# EAGLE design RB01 (EAGLE 6.3)
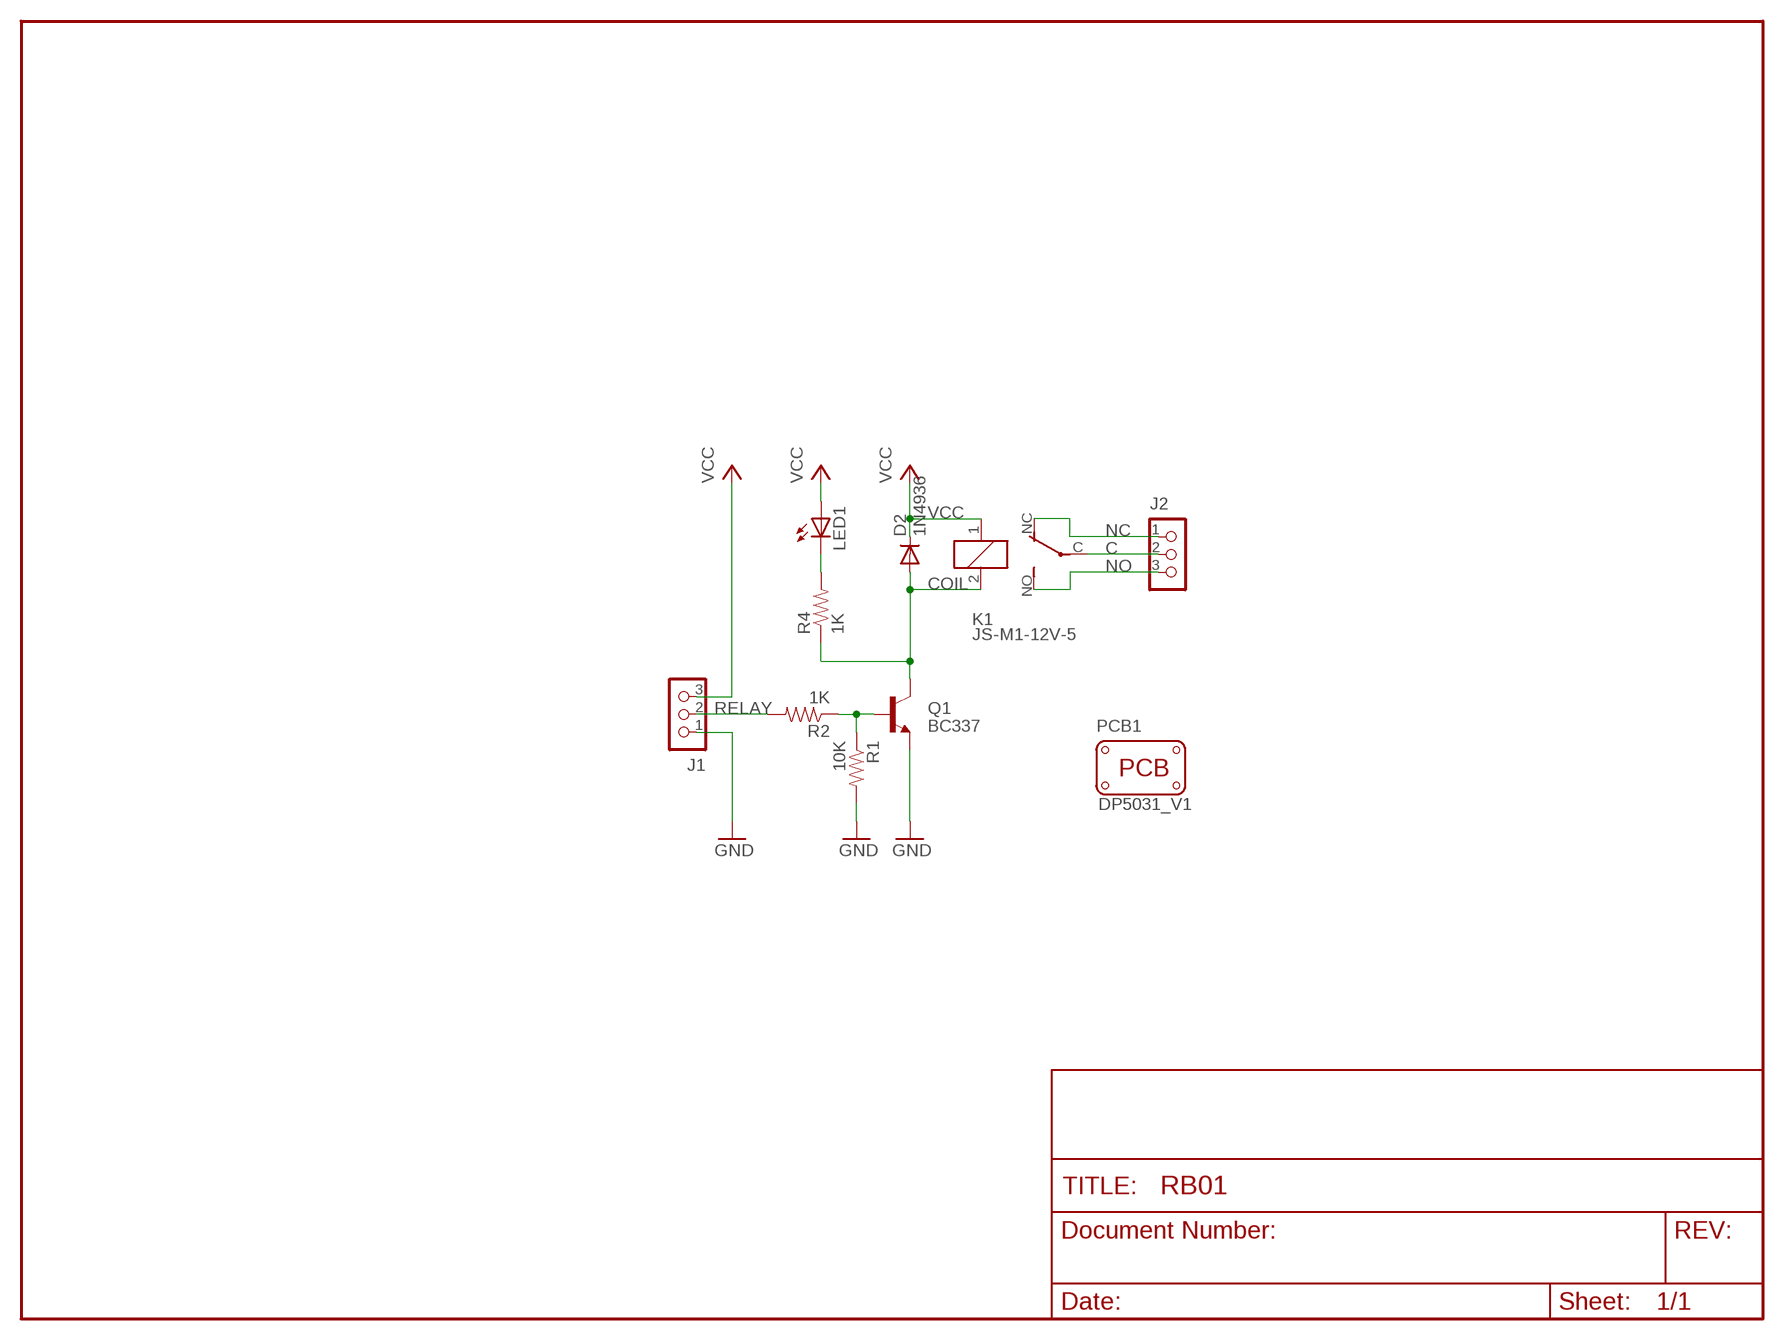
[diagram p0: schematic, sheet 1]

## Parts
D2  1N4936  1N4933  [DO41-10]
J1  CON_TERMINAL_BLOCK_03-5MM  [TERMINAL_BLOCK_3P_5]
J2  CON_TERMINAL_BLOCK_03-5MM  [TERMINAL_BLOCK_3P_5]
K1  JS-M1-12V-5  [JS-M]
LED1  LED-3MM  [LED-3MM]
PCB1  PCB_DP_RECTANGLE-31X50  [DP5031_V1]
Q1  BC337  [TO92]
R1  10K  RESISTORAXIAL-0.3  [AXIAL-0.3]
R2  1K  RESISTORAXIAL-0.3  [AXIAL-0.3]
R4  1K  RESISTORAXIAL-0.3  [AXIAL-0.3]

## Nets
C: J2.2 K1.C(2:P)
COIL: D2.A K1.2 Q1.3(C) R4.P$1
GND: J1.1 Q1.1(E) R1.P$2
N$6: Q1.2(B) R1.P$1 R2.P$1
N$9: LED1.K(C) R4.P$2
NC: J2.1 K1.NC(2:O)
NO: J2.3 K1.NO(2:S)
RELAY: J1.2 R2.P$2
VCC: D2.C J1.3 K1.1 LED1.A

## Library data of the parts
D2 = diode:1N4933: DIODE fast recovery rectifier, 1A
J1 J2 = dp_devices:CON_TERMINAL_BLOCK_03: 3 poles, wire to board connector
K1 = relay:JS-M1*: Automotive Ultra-Miniature Power Relay NAiS Source: http://www.mew-europe.com/.. en_ds_61211_0000.pdf; MF: FARNELL; MPN: JSM1-12V-5; OC_FARNELL: 910351; OC_NEWARK: 14J1764
LED1 = dp_devices:LED: Light Emitting Diode
PCB1 = dp_devices:PCB_DP_RECTANGLE: Dangerous Prototypes Standard Rectangular PCB sizes; PCB_SIZE: DP5031_V1
Q1 = transistor:BC337: NPN TRANSISTOR
R1 R2 R4 = SparkFun:RESISTOR: Resistor Basic schematic elements and footprints for 0603, 1206, and PTH resistors.

## Board
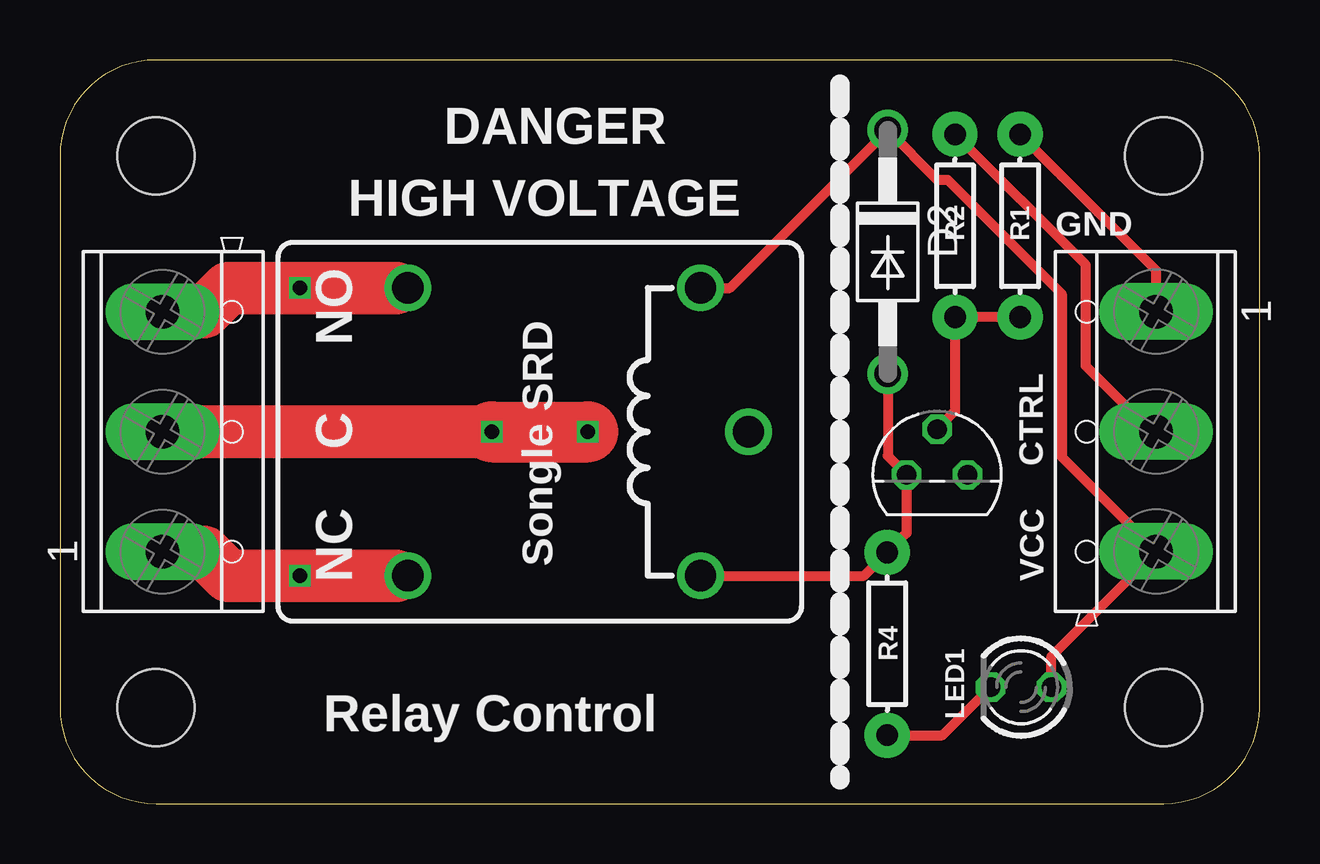
[diagram p1: board, top side]
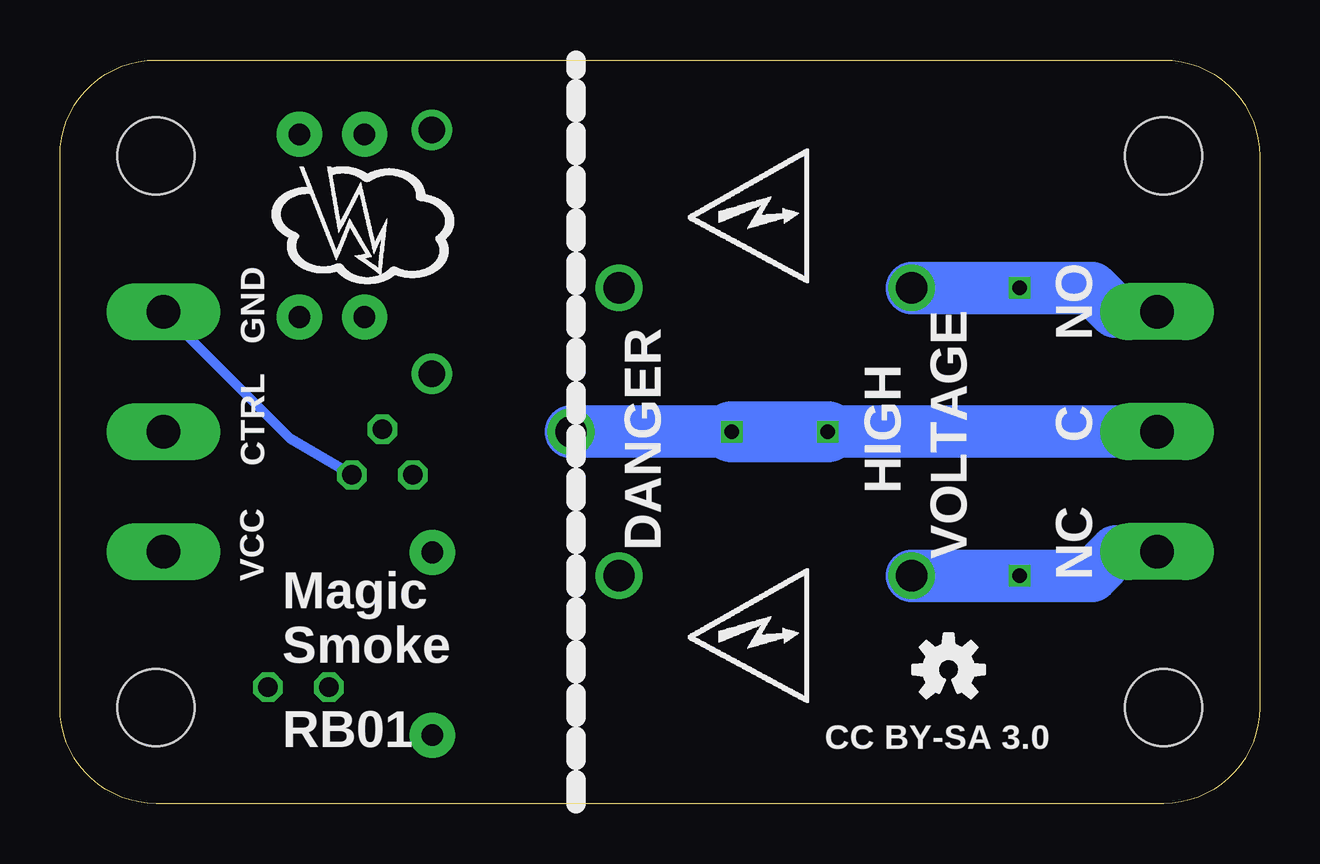
[diagram p2: board, bottom side, seen from below]

Size 50 x 31 mm. Coordinates in mm from the lower left corner, seen from the top.
Copper layers (1*2*15*16): Top 0.035mm / dielectric 0.2mm / Route2 0.0175mm / dielectric 1.1mm / Route15 0.0175mm / dielectric 0.2mm / Bottom 0.035mm
Design rules "SeeedStudio_DRU_no_angle_20130527": minimum track width 6mil, minimum drill 12mil, track to track 6mil, track to pad 6mil, pad to pad 6mil, via to via 6mil, smd to smd 0mil, copper to edge 10mil, drill to drill 10mil, minimum pad ring 6mil, minimum via ring 6mil, stop-mask expansion 2mil, vias tented up to drill 25mil, thermal gap 10mil

### Footprints (pad centres in the part's own frame; a part is rotated, then mirrored left to right if it is on the bottom)
DO41-10 = drill 1.118: A 5.08,0; C -5.08,0
TERMINAL_BLOCK_3P_5 = drill 1.4 pad 2.38 long: 1 5,-0.45; 2 0,-0.45; 3 -5,-0.45
JS-M = drill 1.3: 1 6.7,6; 2 6.7,-6; C 8.7,0; NC -5.5,-6; NO -5.5,6
LED-3MM = drill 0.813 octagon: A -1.27,0; K 1.27,0
DP5031_V1 = hole 3.2: 4,4; 46,4; 46,27; 4,27
TO92 = drill 0.813 octagon: 1 1.27,0; 2 0,1.905; 3 -1.27,0
AXIAL-0.3 = drill 0.9 pad 1.88: P$1 -3.81,0; P$2 3.81,0

### Placement (x,y rotation side)
D2  34.5,23 270 top
J1  45.25,15.51 90 top
J2  4.72,15.5 270 top
K1  20,15.5 0 top
LED1  40.06,4.85 180 top
PCB1  0,0 0 top
Q1  36.56,13.7 0 top
R1  40.02,24.09 90 top
R2  37.31,24.09 90 top
R4  34.48,6.66 270 top
U$2  [OSHW-LOGO-S]  12.96,5.58 0 bottom

### Tracks (layer width: path | path; a pad name or v marks a point on that pad's centre or on a via)
C  (via drill 0.6)
  Top 2.184: 4,15.5 v18,15.5 19.5,15.5 | 19.5,15.5 v22,15.5 | J2.2 19.5,15.5 | 19.5,15.5
  Top 2.54: v18,15.5 v22,15.5
  Bottom 2.184: J2.2 K1.C | K1.C
  Bottom 2.54: v18,15.5 v22,15.5
COIL
  Top 0.406: K1.2 33.51,9.5 R4.P$1 35.29,11.28 Q1.3 34.5,14.49 D2.A
GND
  Top 0.406: J1.1 45.7,22.23 R1.P$2
  Bottom 0.406: Q1.1 40.39,15.2 J1.1
N$6
  Top 0.406: Q1.2 37.31,16.36 R2.P$1 R1.P$1
N$9
  Top 0.406: R4.P$2 36.79,2.85 LED1.K
NC  (via drill 0.6)
  Top 2.184: 14,9.5 v10,9.5 7,9.5 6,10.5 5,10.5
  Bottom 2.184: J2.1 6,10.5 7,9.5 v10,9.5 K1.NC
NO  (via drill 0.6)
  Top 2.184: 14,21.5 v10,21.5 7,21.5 6,20.5 5,20.5
  Bottom 2.184: J2.3 6,20.5 7,21.5 v10,21.5 K1.NO
RELAY
  Top 0.406: J1.2 45.49,15.51 42.75,18.25 42.75,22.46 R2.P$2
VCC
  Top 0.406: LED1.A 41.33,6.14 J1.3 41.75,14.45 41.75,21.25 37,26 36.58,26 D2.C 27.92,21.5 K1.1

### Text on the board
tPlace: DANGER | HIGH VOLTAGE | GND | NO | C | CTRL | NC | Songle SRD | VCC | Relay Control
bPlace: VOLTAGE | DANGER | NO | GND | HIGH | C | CTRL | NC | VCC | Magic / Smoke | CC BY-SA 3.0 | RB01
200bmp: /Users/thomasprice/Documents/eagle/logo/Magic_Smoke_logo.bmp